# EAGLE design MK2560EM-G v2 (EAGLE 9.6.2)
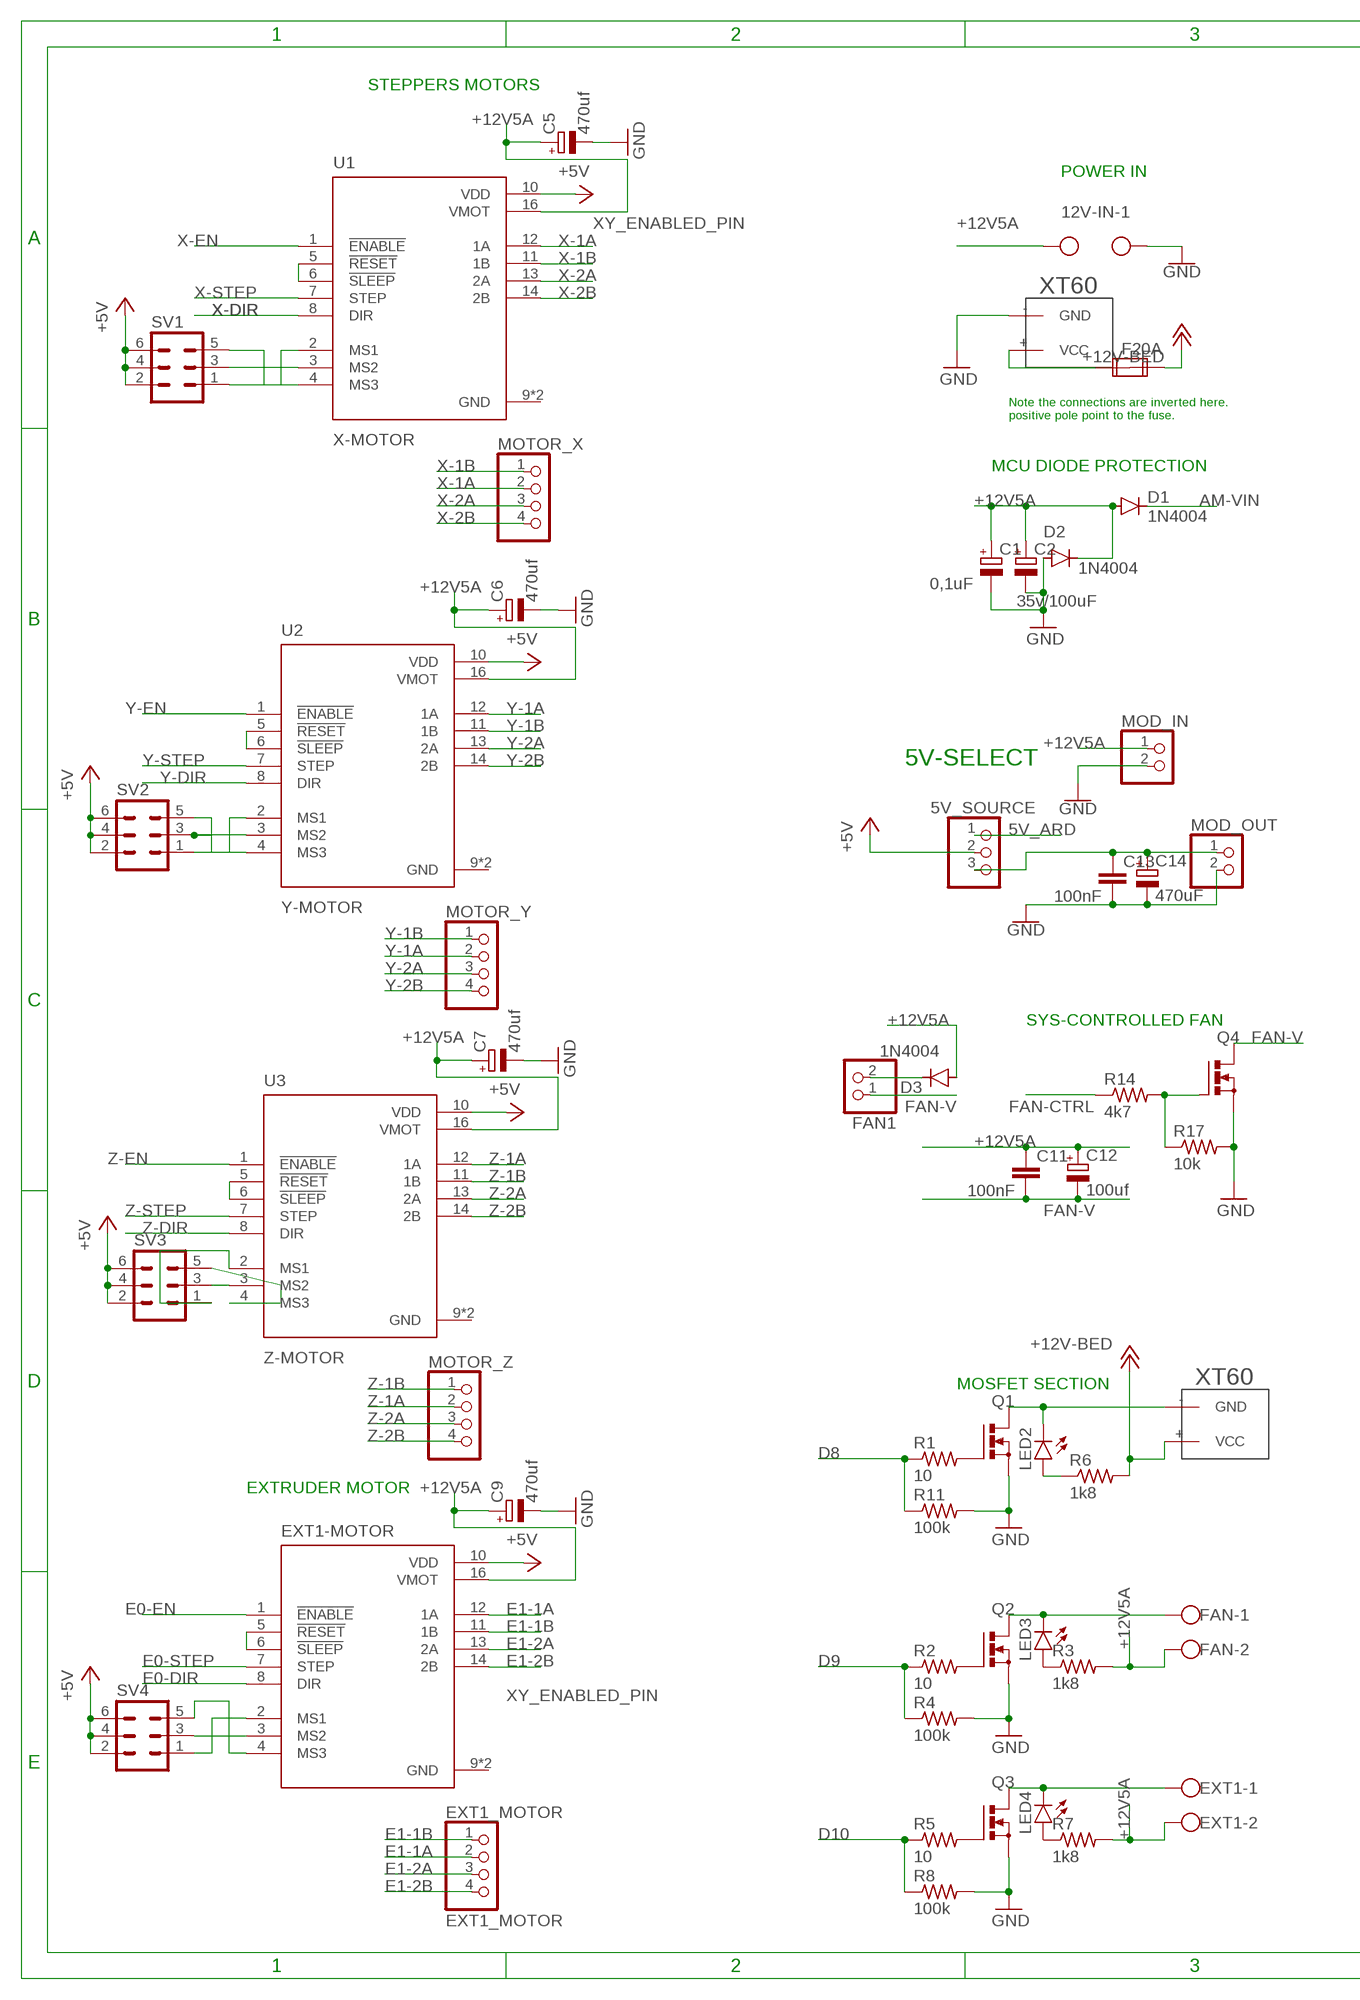
[diagram p0: schematic, sheet 1, part 1 of 2]
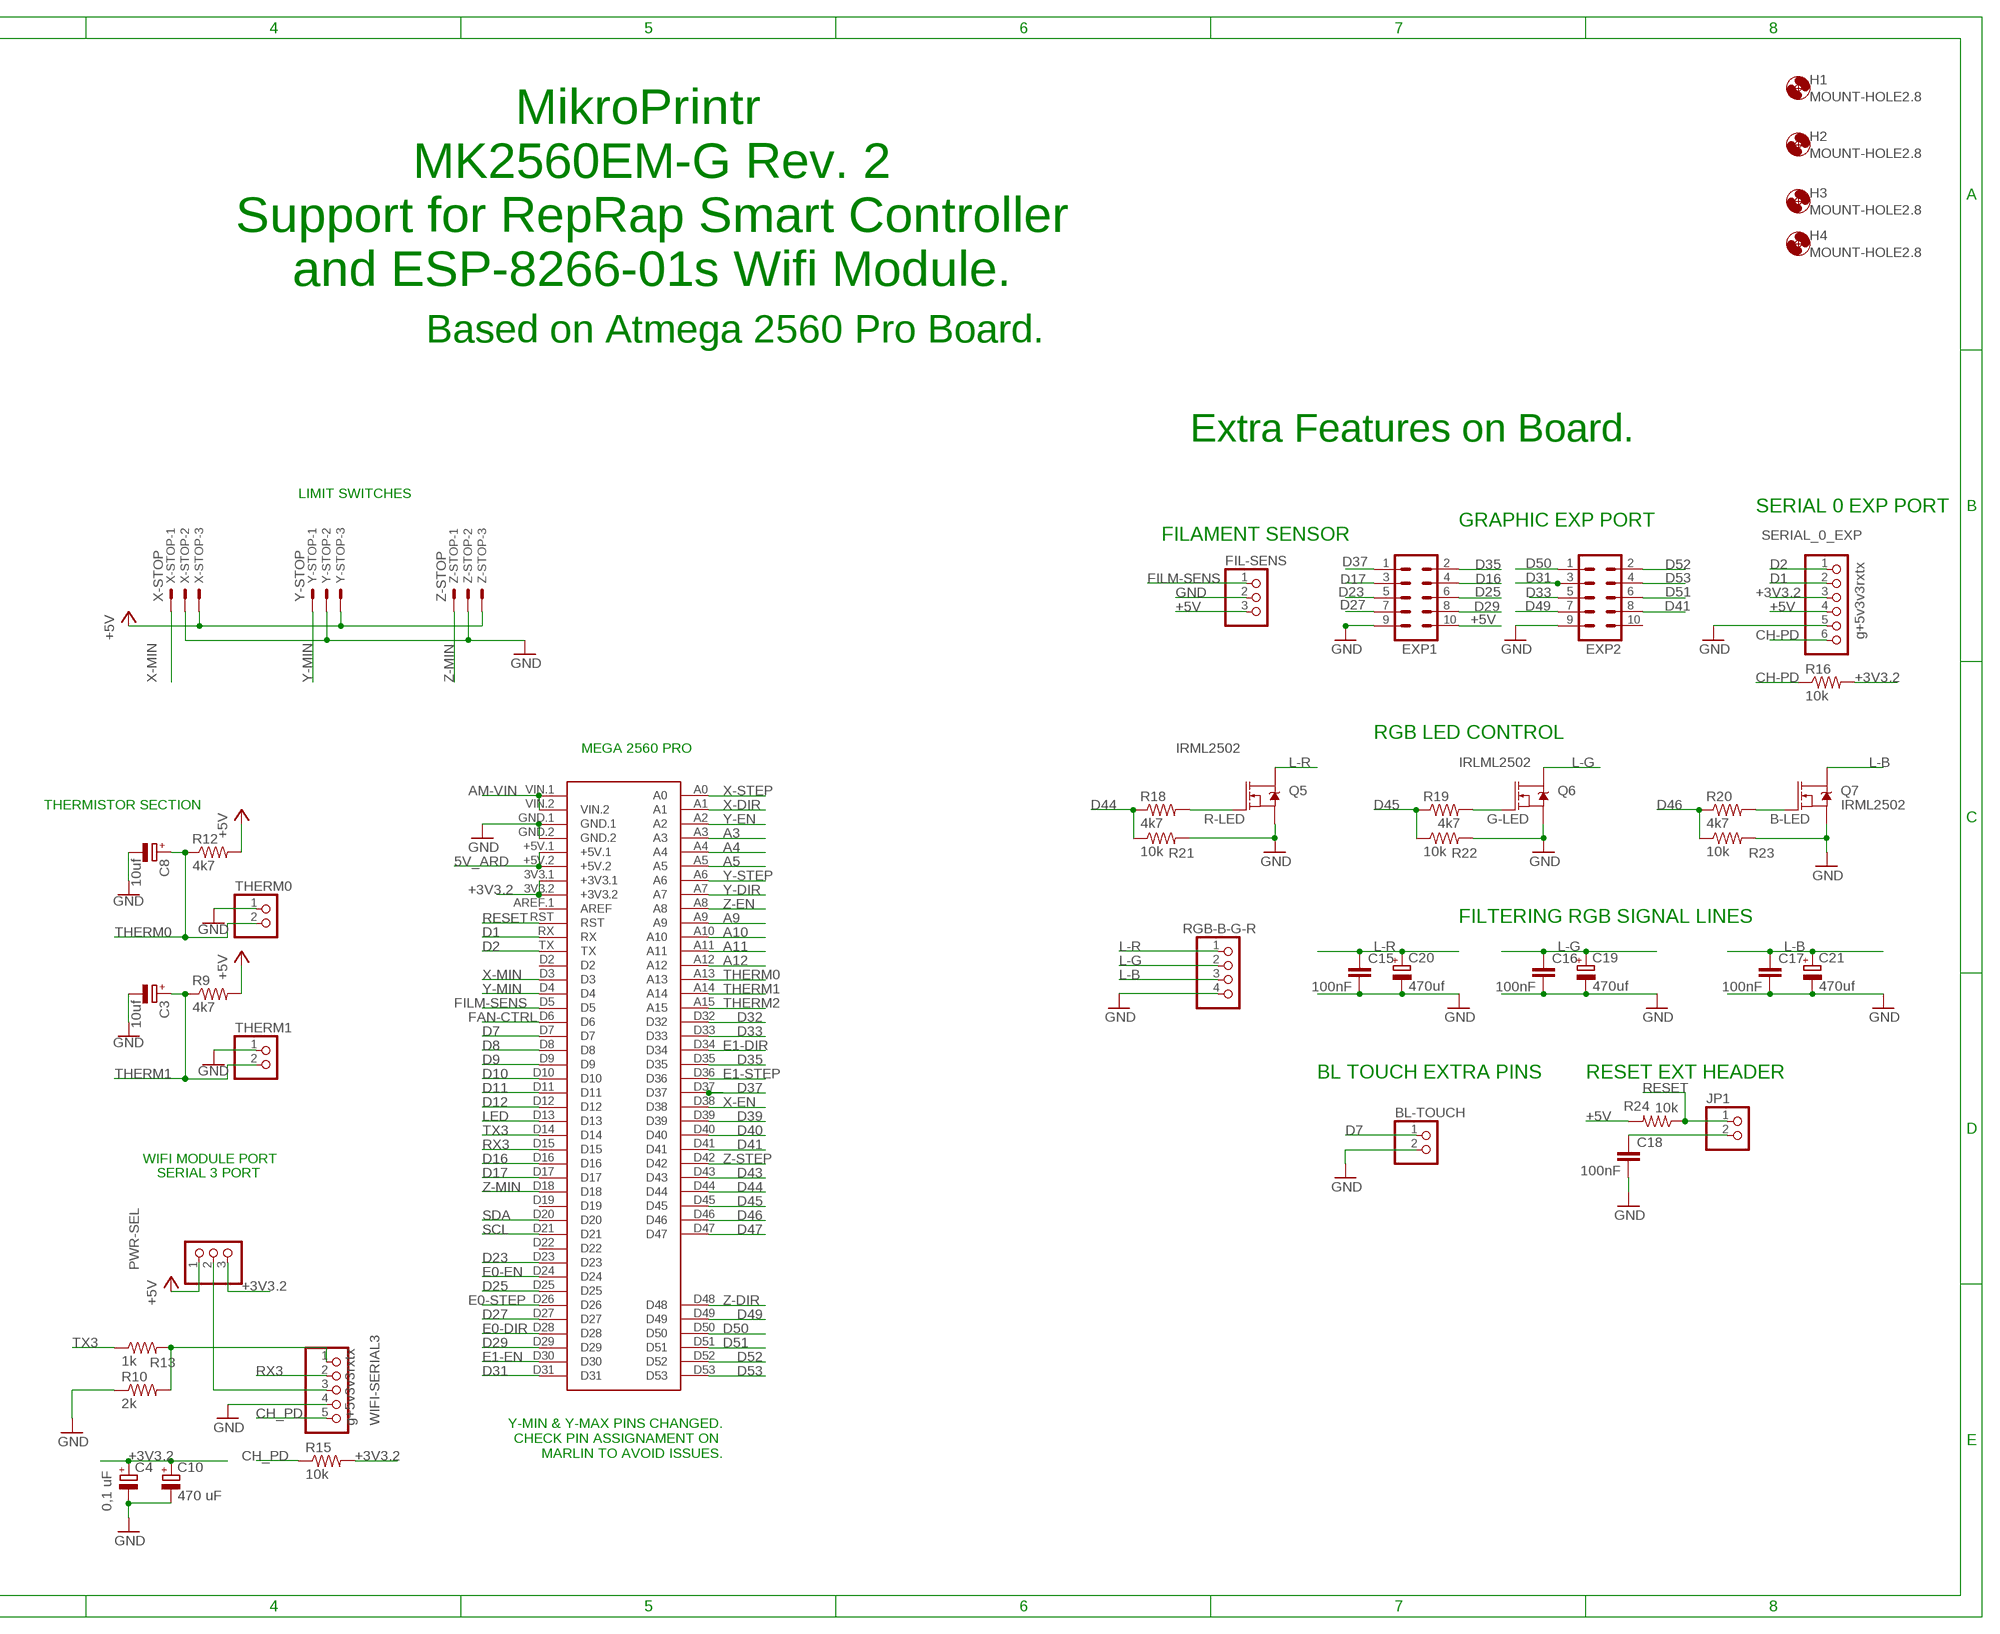
[diagram p1: schematic, sheet 1, part 2 of 2]

## Parts
5V_SOURCE  PINHD-1X3  [1X03]
12V-IN  W237-102  [W237-102]
ARD-MEGA  MEGA2560_MIKRO  [MEGA2560_MIKRO]
BL-TOUCH  PINHD-1X2  [1X02]
C1  0,1uF  CPOL-EUE2.5-5  [E2,5-5]
C2  35v/100uF  CPOL-EUE2.5-5  [E2,5-5]
C3  10uf  CPOL-EUE2.5-6  [E2,5-6]
C4  0,1 uF  CPOL-EUE2.5-5  [E2,5-5]
C5  470uf  CPOL-EUE2,5-6E  [E2,5-6E]
C6  470uf  CPOL-EUE2,5-6E  [E2,5-6E]
C7  470uf  CPOL-EUE2,5-6E  [E2,5-6E]
C8  10uf  CPOL-EUE2.5-6  [E2,5-6]
C9  470uf  CPOL-EUE2,5-6E  [E2,5-6E]
C10  470 uF  CPOL-EUE2.5-5  [E2,5-5]
C11  100nF  C2.5/2  [C2.5-2]
C12  100uf  CPOL-EUE2.5-6  [E2,5-6]
C13  100nF  C2.5/2  [C2.5-2]
C14  470uF  CPOL-EUE2.5-6  [E2,5-6]
C15  100nF  C2.5/2  [C2.5-2]
C16  100nF  C2.5/2  [C2.5-2]
C17  100nF  C2.5/2  [C2.5-2]
C18  100nF  C2.5/2  [C2.5-2]
C19  470uf  CPOL-EUE2,5-6E  [E2,5-6E]
C20  470uf  CPOL-EUE2,5-6E  [E2,5-6E]
C21  470uf  CPOL-EUE2,5-6E  [E2,5-6E]
D1  1N4004  [DO41-10]
D2  1N4004  [DO41-10]
D3  1N4004  [DO41-10]
EXP1  MA05-2  [MA05-2]
EXP2  MA05-2  [MA05-2]
EXT1  W237-102  [W237-102]
EXT1-MOTOR  A4988_STEPPER_MOTOR_DRIVER_CARRIER  [MODULE_A4988_STEPPER_MOTOR_DRIVER_CARRIER]
EXT1_MOTOR  EXT1_MOTOR  PINHD-1X4  [1X04]
F20A  FUSE2P  [FUSE1]
FAN  W237-102  [W237-102]
FAN1  PINHD-1X2  [1X02]
FIL-SENS  PINHD-1X3  [1X03]
H1  MOUNT-HOLE2.8  [2,8]
H2  MOUNT-HOLE2.8  [2,8]
H3  MOUNT-HOLE2.8  [2,8]
H4  MOUNT-HOLE2.8  [2,8]
JP1  PINHD-1X2  [1X02]
LED2  LED3MM  [LED3MM]
LED3  LED3MM  [LED3MM]
LED4  LED3MM  [LED3MM]
MOD_IN  PINHD-1X2  [1X02]
MOD_OUT  PINHD-1X2  [1X02]
MOTOR_X  PINHD-1X4  [1X04]
MOTOR_Y  PINHD-1X4  [1X04]
MOTOR_Z  PINHD-1X4  [1X04]
PWR-SEL  PINHD-1X3  [1X03]
Q1  PMOSFET_NTO220BV  [TO220BV]
Q2  PMOSFET_NTO220BV  [TO220BV]
Q3  PMOSFET_NTO220BV  [TO220BV]
Q4  PMOSFET_NTO220BV  [TO220BV]
Q5  IRML2502  MOSFET-NCH-AO3404A  [SOT23-3]
Q6  IRLML2502  MOSFET-NCH-AO3404A  [SOT23-3]
Q7  IRML2502  MOSFET-NCH-AO3404A  [SOT23-3]
R1  10  R-US_0204/7  [0204/7]
R2  10  R-US_0204/7  [0204/7]
R3  1k8  R-US_0204/7  [0204/7]
R4  100k  R-US_0204/7  [0204/7]
R5  10  R-US_0204/7  [0204/7]
R6  1k8  R-US_0204/7  [0204/7]
R7  1k8  R-US_0204/7  [0204/7]
R8  100k  R-US_0204/7  [0204/7]
R9  4k7  R-US_0204/7  [0204/7]
R10  2k  R-US_0204/7  [0204/7]
R11  100k  R-US_0204/7  [0204/7]
R12  4k7  R-US_0204/7  [0204/7]
R13  1k  R-US_0204/7  [0204/7]
R14  4k7  R-US_0204/7  [0204/7]
R15  10k  R-US_0204/7  [0204/7]
R16  10k  R-US_0204/7  [0204/7]
R17  10k  R-US_0204/7  [0204/7]
R18  4k7  R-US_0204/7  [0204/7]
R19  4k7  R-US_0204/7  [0204/7]
R20  4k7  R-US_0204/7  [0204/7]
R21  10k  R-US_0204/7  [0204/7]
R22  10k  R-US_0204/7  [0204/7]
R23  10k  R-US_0204/7  [0204/7]
R24  10k  R-US_0204/7  [0204/7]
RGB-B-G-R  PINHD-1X4  [1X04]
SERIAL_0_EXP  g+5v3v3rxtx  PINHD-1X6  [1X06]
SV1  MA03-2  [MA03-2]
SV2  MA03-2  [MA03-2]
SV3  MA03-2  [MA03-2]
SV4  MA03-2  [MA03-2]
THERM0  PINHD-1X2  [1X02]
THERM1  PINHD-1X2  [1X02]
U1  X-MOTOR  A4988_STEPPER_MOTOR_DRIVER_CARRIER  [MODULE_A4988_STEPPER_MOTOR_DRIVER_CARRIER]
U2  Y-MOTOR  A4988_STEPPER_MOTOR_DRIVER_CARRIER  [MODULE_A4988_STEPPER_MOTOR_DRIVER_CARRIER]
U3  Z-MOTOR  A4988_STEPPER_MOTOR_DRIVER_CARRIER  [MODULE_A4988_STEPPER_MOTOR_DRIVER_CARRIER]
U$1  XT60  [XT60]
U$2  XT60  [XT60]
WIFI-SERIAL3  g+5v3v3rxtx  PINHD-1X5  [1X05]
X-STOP  X-STOP  22-23-2031  [22-23-2031]
Y-STOP  Y-STOP  22-23-2031  [22-23-2031]
Z-STOP  Z-STOP  22-23-2031  [22-23-2031]

## Nets
5V_ARD: 5V_SOURCE.1 ARD-MEGA.+5V.1 ARD-MEGA.+5V.2
+3V3.2: ARD-MEGA.3V3.1(+3V3.1) ARD-MEGA.3V3.2(+3V3.2) C4.+ C10.+ PWR-SEL.3 R15.2 R16.2 SERIAL_0_EXP.3
+5V: 5V_SOURCE.2 EXP1.10 EXT1-MOTOR.10(VDD) FIL-SENS.3 PWR-SEL.1 R9.2 R12.2 R24.2 SERIAL_0_EXP.4 SV1.2 SV1.4 SV1.6 SV2.2 SV2.4 SV2.6 SV3.2 SV3.4 SV3.6 SV4.2 SV4.4 SV4.6 U1.10(VDD) U2.10(VDD) U3.10(VDD) X-STOP.3 Y-STOP.3 Z-STOP.3
+12V: F20A.2A R6.2 U$2.+(VCC) ; supply symbol labelled +12V-BED
+12V5A: 12V-IN.2 C1.+ C2.+ C5.+ C6.+ C7.+ C9.+ C11.1 C12.+ D1.A D2.C D3.A EXT1-MOTOR.16(VMOT) EXT1.2 FAN.2 MOD_IN.1 R3.2 R7.2 U1.16(VMOT) U2.16(VMOT) U3.16(VMOT)
A3: ARD-MEGA.A3
A4: ARD-MEGA.A4
A5: ARD-MEGA.A5
A9: ARD-MEGA.A9
A10: ARD-MEGA.A10
A11: ARD-MEGA.A11
A12: ARD-MEGA.A12
AM-VIN: ARD-MEGA.VIN.1 ARD-MEGA.VIN.2 D1.C
B-LED: Q7.1(G) R20.2
CH-PD: R16.1 SERIAL_0_EXP.6
CH_PD: R15.1 WIFI-SERIAL3.5
D1: ARD-MEGA.RX SERIAL_0_EXP.2
D2: ARD-MEGA.TX SERIAL_0_EXP.1
D7: ARD-MEGA.D7 BL-TOUCH.1
D8: ARD-MEGA.D8 R1.1 R11.1
D9: ARD-MEGA.D9 R2.1 R4.1
D10: ARD-MEGA.D10 R5.1 R8.1
D11: ARD-MEGA.D11
D12: ARD-MEGA.D12
D16: ARD-MEGA.D16 EXP1.4
D17: ARD-MEGA.D17 EXP1.3
D23: ARD-MEGA.D23 EXP1.5
D25: ARD-MEGA.D25 EXP1.6
D27: ARD-MEGA.D27 EXP1.7
D29: ARD-MEGA.D29 EXP1.8
D31: ARD-MEGA.D31 EXP2.3
D32: ARD-MEGA.D32
D33: ARD-MEGA.D33 EXP2.5
D35: ARD-MEGA.D35 EXP1.2
D37: ARD-MEGA.D37 EXP1.1
D39: ARD-MEGA.D39
D40: ARD-MEGA.D40
D41: ARD-MEGA.D41 EXP2.8
D43: ARD-MEGA.D43
D44: ARD-MEGA.D44 R18.1 R21.1
D45: ARD-MEGA.D45 R19.1 R22.1
D46: ARD-MEGA.D46 R20.1 R23.1
D47: ARD-MEGA.D47
D49: ARD-MEGA.D49 EXP2.7
D50: ARD-MEGA.D50 EXP2.1
D51: ARD-MEGA.D51 EXP2.6
D52: ARD-MEGA.D52 EXP2.2
D53: ARD-MEGA.D53 EXP2.4
E0-DIR: ARD-MEGA.D28 EXT1-MOTOR.8(DIR)
E0-EN: ARD-MEGA.D24 EXT1-MOTOR.1(!ENABLE)
E0-STEP: ARD-MEGA.D26 EXT1-MOTOR.7(STEP)
E1-1A: EXT1-MOTOR.12(1A) EXT1_MOTOR.2
E1-1B: EXT1-MOTOR.11(1B) EXT1_MOTOR.1
E1-2A: EXT1-MOTOR.13(2A) EXT1_MOTOR.3
E1-2B: EXT1-MOTOR.14(2B) EXT1_MOTOR.4
E1-DIR: ARD-MEGA.D34
E1-EN: ARD-MEGA.D30
E1-STEP: ARD-MEGA.D36
FAN-CTRL: ARD-MEGA.D6 R14.1
FAN-V: C11.2 C12.- FAN1.1 Q4.D
FILM-SENS: ARD-MEGA.D5 FIL-SENS.1
G-LED: Q6.1(G) R19.2
GND: 12V-IN.1 ARD-MEGA.GND.1 ARD-MEGA.GND.2 BL-TOUCH.2 C1.- C2.- C3.- C4.- C5.- C6.- C7.- C8.- C9.- C10.- C13.2 C14.- C15.2 C16.2 C17.2 C18.2 C19.- C20.- C21.- D2.A EXP1.9 EXP2.9 FIL-SENS.2 MOD_IN.2 MOD_OUT.2 Q1.S Q2.S Q3.S Q4.S Q5.2(S) Q6.2(S) Q7.2(S) R4.2 R8.2 R10.1 R11.2 R17.2 R21.2 R22.2 R23.2 RGB-B-G-R.4 SERIAL_0_EXP.5 THERM0.1 THERM1.1 U$1.-(GND) WIFI-SERIAL3.4 X-STOP.2 Y-STOP.2 Z-STOP.2
L-B: C17.1 C21.+ Q7.3(D) RGB-B-G-R.3
L-G: C16.1 C19.+ Q6.3(D) RGB-B-G-R.2
L-R: C15.1 C20.+ Q5.3(D) RGB-B-G-R.1
LED: ARD-MEGA.D13
N$1: Q2.G R2.2
N$2: FAN.1 LED3.K(C) Q2.D
N$3: LED3.A R3.1
N$4: Q3.G R5.2
N$5: EXT1.1 LED4.K(C) Q3.D
N$6: LED4.A R7.1
N$7: LED2.K(C) Q1.D U$2.-(GND)
N$8: LED2.A R6.1
N$9: SV1.5 U1.4(MS3)
N$10: SV1.3 U1.3(MS2)
N$11: SV1.1 U1.2(MS1)
N$12: U2.5(!RESET) U2.6(!SLEEP)
N$13: U1.5(!RESET) U1.6(!SLEEP)
N$14: SV2.1 U2.2(MS1)
N$15: SV2.3 U2.3(MS2)
N$16: SV2.5 U2.4(MS3)
N$17: U3.5(!RESET) U3.6(!SLEEP)
N$18: R10.2 R13.2 WIFI-SERIAL3.1
N$19: SV3.3 U3.3(MS2)
N$20: Q1.G R1.2
N$21: SV3.1 U3.2(MS1)
N$22: SV3.5 U3.4(MS3)
N$23: EXT1-MOTOR.5(!RESET) EXT1-MOTOR.6(!SLEEP)
N$24: EXT1-MOTOR.3(MS2) SV4.3
N$25: EXT1-MOTOR.4(MS3) SV4.5
N$26: EXT1-MOTOR.2(MS1) SV4.1
N$27: Q4.G R14.2 R17.1
N$28: D3.C FAN1.2
N$29: F20A.1A U$1.+(VCC)
N$30: 5V_SOURCE.3 C13.1 C14.+ MOD_OUT.1
N$32: PWR-SEL.2 WIFI-SERIAL3.3
N$33: C18.1 JP1.2
R-LED: Q5.1(G) R18.2
RESET: ARD-MEGA.RST JP1.1 R24.1
RX3: ARD-MEGA.D15 WIFI-SERIAL3.2
SCL: ARD-MEGA.D21
SDA: ARD-MEGA.D20
THERM0: ARD-MEGA.A13 C8.+ R12.1 THERM0.2
THERM1: ARD-MEGA.A14 C3.+ R9.1 THERM1.2
THERM2: ARD-MEGA.A15
TX3: ARD-MEGA.D14 R13.1
X-1A: MOTOR_X.2 U1.12(1A)
X-1B: MOTOR_X.1 U1.11(1B)
X-2A: MOTOR_X.3 U1.13(2A)
X-2B: MOTOR_X.4 U1.14(2B)
X-DIR: ARD-MEGA.A1 U1.8(DIR)
X-EN: ARD-MEGA.D38 U1.1(!ENABLE)
X-MIN: ARD-MEGA.D3 X-STOP.1
X-STEP: ARD-MEGA.A0 U1.7(STEP)
Y-1A: MOTOR_Y.2 U2.12(1A)
Y-1B: MOTOR_Y.1 U2.11(1B)
Y-2A: MOTOR_Y.3 U2.13(2A)
Y-2B: MOTOR_Y.4 U2.14(2B)
Y-DIR: ARD-MEGA.A7 U2.8(DIR)
Y-EN: ARD-MEGA.A2 U2.1(!ENABLE)
Y-MIN: ARD-MEGA.D4 Y-STOP.1
Y-STEP: ARD-MEGA.A6 U2.7(STEP)
Z-1A: MOTOR_Z.2 U3.12(1A)
Z-1B: MOTOR_Z.1 U3.11(1B)
Z-2A: MOTOR_Z.3 U3.13(2A)
Z-2B: MOTOR_Z.4 U3.14(2B)
Z-DIR: ARD-MEGA.D48 U3.8(DIR)
Z-EN: ARD-MEGA.A8 U3.1(!ENABLE)
Z-MIN: ARD-MEGA.D18 Z-STOP.1
Z-STEP: ARD-MEGA.D42 U3.7(STEP)
Unconnected: ARD-MEGA.AREF.1(AREF) ARD-MEGA.D2 ARD-MEGA.D19 ARD-MEGA.D22 EXP2.10 F20A.1B F20A.2B

## Notes on the sheet
- STEPPERS MOTORS
- POWER IN
- MikroPrintr  
  MK2560EM-G Rev. 2
  Support for RepRap Smart Controller
  and ESP-8266-01s Wifi Module.
- Note the connections are inverted here.
  positive pole point to the fuse.
- Based on Atmega 2560 Pro Board.
- MCU DIODE PROTECTION
- Extra Features on Board.
- LIMIT SWITCHES
- SERIAL 0 EXP PORT
- GRAPHIC EXP PORT
- FILAMENT SENSOR
- 5V-SELECT
- RGB LED CONTROL
- MEGA 2560 PRO
- THERMISTOR SECTION
- SYS-CONTROLLED FAN
- FILTERING RGB SIGNAL LINES
- BL TOUCH EXTRA PINS | RESET EXT HEADER
- MOSFET SECTION
- WIFI MODULE PORT
- SERIAL 3 PORT
- EXTRUDER MOTOR
- Y-MIN & Y-MAX PINS CHANGED.
  CHECK PIN ASSIGNAMENT ON 
  MARLIN TO AVOID ISSUES.

## Power pins joined to a net without a drawn wire
GND: EXT1-MOTOR.9(GND) EXT1-MOTOR.15(GND) U1.9(GND) U1.15(GND) U2.9(GND) U2.15(GND) U3.9(GND) U3.15(GND)

## Library data of the parts
5V_SOURCE = pinhead:PINHD-1X3: PIN HEADER
12V-IN EXT1 FAN = con-wago-500:W237-102: WAGO SCREW CLAMP; MPN: 237-102; OC_FARNELL: unknown; OC_NEWARK: 70K9898
ARD-MEGA = MIKRO_MEGA2560:MEGA2560_MIKRO: Arduino Mega2560 pro robotDyn, create by mikroavr.com
BL-TOUCH JP1 THERM0 THERM1 = -redpic-connector:PINHD-1X2: Pin Header 2
C1-C10 C12 C14 C19-C21 = rcl:CPOL-EU: POLARIZED CAPACITOR, European symbol; SPICEPREFIX: C
C11 C13 C15-C18 = capacitor-wima:C: CAPACITOR naming: grid - package width
D1-D3 = diode:1N4004: DIODE general purpose rectifier, 1 A
EXP1 EXP2 = con-lstb:MA05-2: PIN HEADER; OC_FARNELL: unknown; OC_NEWARK: unknown
EXT1-MOTOR U1-U3 = A4988_STEPPER_MOTOR_DRIVER_CARRIER:A4988_STEPPER_MOTOR_DRIVER_CARRIER: Stepper motor controler; IC: A4988; 1A; Uin mot: 8÷35V Check availability <https://pricing.snapeda.com/parts/A4988%20STEPPER%20MOTOR%20DRIVER%20CARRIER/Pololu/view-part?ref=eda>; AVAILABILITY: Not in stock; DESCRIPTION: Stepper Motor Driver; MF: Pololu; MP: A4988 STEPPER MOTOR DRIVER CARRIER; PACKAGE: None; PRICE: None
EXT1_MOTOR MOTOR_X MOTOR_Y MOTOR_Z RGB-B-G-R = -redpic-connector:PINHD-1X4: Pin Header 4
F20A = special:FUSE2P: FUSE 5 x 20 mm
FAN1 MOD_IN MOD_OUT = pinhead:PINHD-1X2: PIN HEADER
FIL-SENS PWR-SEL = -redpic-connector:PINHD-1X3: Pin Header 3
H1-H4 = holes:MOUNT-HOLE: MOUNTING HOLE with drill center marker
LED2-LED4 = led:LED: LED OSRAM: - CHIPLED LG R971, LG N971, LY N971, LG Q971, LY Q971, LO R971, LY R971 LH N974, LH R974 LS Q976, LO Q976, LY Q976 LO Q996 - Hyper CHIPLED LW Q18S LB Q993, LB Q99A, LB R99A - SideLED LS A670, LO A670, LY A670, LG A670, LP A670 LB A673, LV A673, LT A673, LW A673 LH A674 LY A675 LS A676, LA A676, LO A676, LY A676, LW A676 LS A679, LY A679, LG A679 - Hyper Micro SIDELED® LS Y876, LA Y876, LO Y876, LY Y876 LT Y87S - SmartLED LW L88C, LW L88S LB L89C, LB L89S, LG L890 LS L89K, LO L89K, LY L89K LS L896, LA L896, LO L896, LY L896 - TOPLED LS T670, LO T670, LY T670, LG T670, LP T670 LSG T670, LSP T670, LSY T670, LOP T670, LYG T670 LG T671, LOG T671, LSG T671 LB T673, LV T673, LT T673, LW T673 LH T674 LS T676, LA T676, LO T676, LY T676, LB T676, LH T676, LSB T676, LW T676 LB T67C, LV T67C, LT T67C, LS T67K, LO T67K, LY T67K, LW E67C LS E67B, LA E67B, LO E67B, LY E67B, LB E67C, LV E67C, LT E67C LW T67C LS T679, LY T679, LG T679 LS T770, LO T770, LY T770, LG T770, LP T770 LB T773, LV T773, LT T773, LW T773 LH T774 LS E675, LA E675, LY E675, LS T675 LS T776, LA T776, LO T776, LY T776, LB T776 LHGB T686 LT T68C, LB T68C - Hyper Mini TOPLED® LB M676 - Mini TOPLED Santana® LG M470 LS M47K, LO M47K, LY M47K Source: http://www.osram.convergy.de LUXEON: - LUMILED® LXK2-PW12-R00, LXK2-PW12-S00, LXK2-PW14-U00, LXK2-PW14-V00 LXK2-PM12-R00, LXK2-PM12-S00, LXK2-PM14-U00 LXK2-PE12-Q00, LXK2-PE12-R00, LXK2-PE12-S00, LXK2-PE14-T00, LXK2-PE14-U00 LXK2-PB12-K00, LXK2-PB12-L00, LXK2-PB12-M00, LXK2-PB14-N00, LXK2-PB14-P00, LXK2-PB14-Q00 LXK2-PR12-L00, LXK2-PR12-M00, LXK2-PR14-Q00, LXK2-PR14-R00 LXK2-PD12-Q00, LXK2-PD12-R00, LXK2-PD12-S00 LXK2-PH12-R00, LXK2-PH12-S00 LXK2-PL12-P00, LXK2-PL12-Q00, LXK2-PL12-R00 Source: www.luxeon.com KINGBRIGHT: KA-3528ASYC Source: www.kingbright.com
Q1-Q4 = transistor-power:PMOSFET_N: Power MOSFET N-Channel
Q5-Q7 = SparkFun-DiscreteSemi:MOSFET-NCH: N-channel MOSFETs Voltage controlled devices that allow control of high current outputs. SparkFun Products: SparkFun OpenScale <https://www.sparkfun.com/products/13261> SparkFun Digital Sandbox <https://www.sparkfun.com/products/12651> SparkFun Monster Moto Shield <https://www.sparkfun.com/products/10182> SparkFun MOSFET Power Controller <https://www.sparkfun.com/products/11214>; PROD_ID: TRANS-12988; VALUE: 5.8A/30V/35mΩ
R1-R24 = resistor:R-US_: RESISTOR, American symbol
SERIAL_0_EXP = pinhead:PINHD-1X6: PIN HEADER
SV1-SV4 = con-lstb:MA03-2: PIN HEADER; OC_FARNELL: unknown; OC_NEWARK: unknown
U$1 U$2 = XT60:XT60: XT60
WIFI-SERIAL3 = pinhead:PINHD-1X5: PIN HEADER
X-STOP Y-STOP Z-STOP = con-molex:22-23-2031: .100" (2.54mm) Center Header - 3 Pin; MF: MOLEX; MPN: 22-23-2031; OC_FARNELL: 1462950; OC_NEWARK: 30C0862

## Board
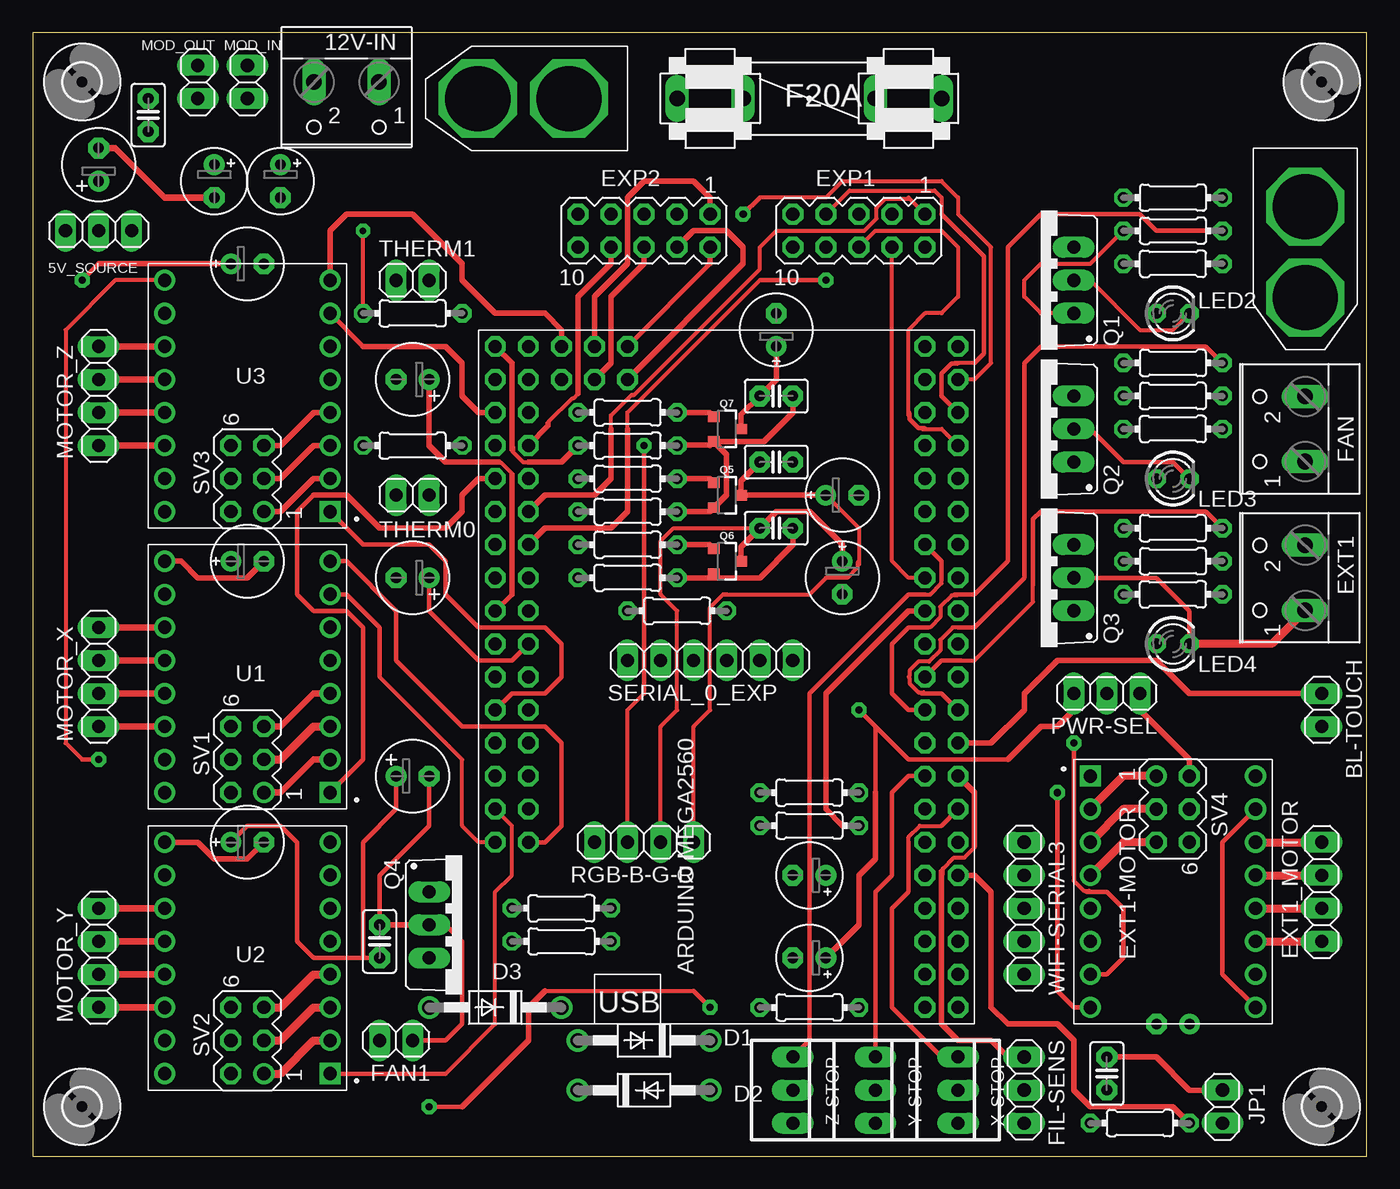
[diagram p2: board, top side]
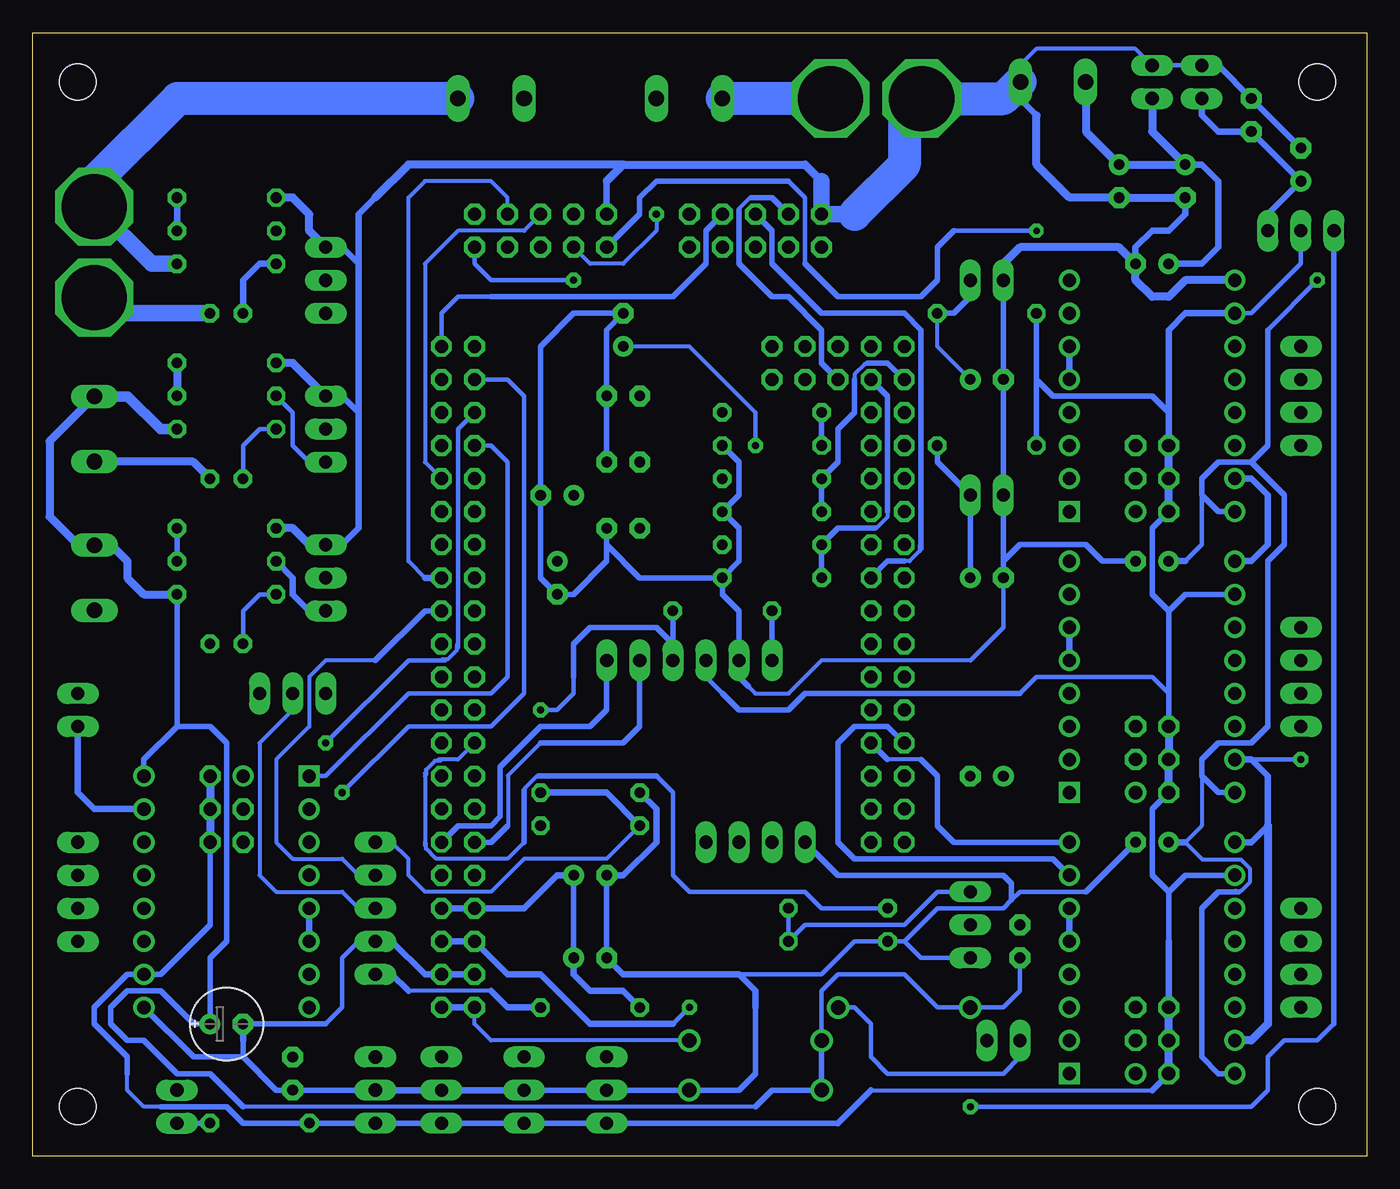
[diagram p3: board, bottom side, seen from below]

Size 102.54 x 86.35 mm. Coordinates in mm from the lower left corner, seen from the top.
Outline: 0,0 102.54,0 102.54,86.35 0,86.35 0,0
Copper layers (1*16): Top 0.035mm / dielectric 1.5mm / Bottom 0.035mm
Design rules "China_JLCPCB": minimum track width 0.25mm, minimum drill 0.5mm, track to track 0.24mm, track to pad 0.23mm, pad to pad 0.2mm, via to via 0.25mm, smd to smd 0.2mm, copper to edge 0.5mm, drill to drill 0.3mm, minimum pad ring 0.3mm, minimum via ring 0.3mm, stop-mask expansion 3mil, vias tented up to drill 0.6mm, thermal gap 20mil

### Footprints (pad centres in the part's own frame; a part is rotated, then mirrored left to right if it is on the bottom)
1X03 = drill 1.016 long: 1 -2.54,0; 2 0,0; 3 2.54,0
W237-102 = drill 1.194 long: 1 -2.5,-1.27; 2 2.5,-1.27
MEGA2560_MIKRO = drill 1 octagon: 3V3.1 -26.67,-17.78; 3V3.2 -26.67,-20.32; +5V.1 -29.21,-17.78; +5V.2 -29.21,-20.32; A0 -21.59,15.24; A1 -21.59,12.7; A2 -19.05,15.24; A3 -19.05,12.7; A4 -16.51,15.24; A5 -16.51,12.7; A6 -13.97,15.24; A7 -13.97,12.7; A8 -11.43,15.24; A9 -11.43,12.7; A10 -8.89,15.24; A11 -8.89,12.7; A12 -6.35,15.24; A13 -6.35,12.7; A14 -3.81,15.24; A15 -3.81,12.7; AREF.1 -24.13,-17.78; D2 -19.05,-17.78; D3 -19.05,-20.32; D4 -16.51,-17.78; D5 -16.51,-20.32; D6 -13.97,-17.78; D7 -13.97,-20.32; D8 -11.43,-17.78; D9 -11.43,-20.32; D10 -8.89,-17.78; D11 -8.89,-20.32; D12 -6.35,-17.78; D13 -6.35,-20.32; D14 -3.81,-17.78; D15 -3.81,-20.32; D16 -1.27,-17.78; D17 -1.27,-20.32; D18 1.27,-17.78; D19 1.27,-20.32; D20 3.81,-17.78; D21 3.81,-20.32; D22 6.35,-17.78; D23 6.35,-20.32; D24 8.89,-17.78; D25 8.89,-20.32; D26 11.43,-17.78; D27 11.43,-20.32; D28 13.97,-17.78; D29 13.97,-20.32; D30 16.51,-17.78; D31 16.51,-20.32; D32 -1.27,15.24; D33 -1.27,12.7; D34 1.27,15.24; D35 1.27,12.7; D36 3.81,15.24; D37 3.81,12.7; D38 6.35,15.24; D39 6.35,12.7; D40 8.89,15.24; D41 8.89,12.7; D42 11.43,15.24; D43 11.43,12.7; D44 13.97,15.24; D45 13.97,12.7; D46 16.51,15.24; D47 16.51,12.7; D48 16.51,10.16; D49 13.97,10.16; D50 16.51,7.62; D51 13.97,7.62; D52 16.51,5.08; D53 13.97,5.08; GND.1 -31.75,-17.78; GND.2 -31.75,-20.32; RST -24.13,-20.32; RX -21.59,-17.78; TX -21.59,-20.32; VIN.1 -34.29,-17.78; VIN.2 -34.29,-20.32
1X02 = drill 1.016 long: 1 -1.27,0; 2 1.27,0
E2,5-5 = drill 0.813 pad 1.6: + -1.27,0 | drill 0.813 pad 1.6 octagon: - 1.27,0
E2,5-6 = drill 0.813 pad 1.6: + -1.27,0 | drill 0.813 pad 1.6 octagon: - 1.27,0
E2,5-6E = drill 0.813 pad 1.575: + -1.27,0 | drill 0.813 pad 1.575 octagon: - 1.27,0
C2.5-2 = drill 0.813 pad 1.6 octagon: 1 -1.27,0; 2 1.27,0
DO41-10 = drill 1.118: A 5.08,0; C -5.08,0
MA05-2 = drill 1.016 octagon: 1 -5.08,-1.27; 2 -5.08,1.27; 3 -2.54,-1.27; 4 -2.54,1.27; 5 0,-1.27; 6 0,1.27; 7 2.54,-1.27; 8 2.54,1.27; 9 5.08,-1.27; 10 5.08,1.27
MODULE_A4988_STEPPER_MOTOR_DRIVER_CARRIER = drill 1.02 square: 1 -6.35,8.89 | drill 1.02: 2 -6.35,6.35; 3 -6.35,3.81; 4 -6.35,1.27; 5 -6.35,-1.27; 6 -6.35,-3.81; 7 -6.35,-6.35; 8 -6.35,-8.89; 9 6.35,-8.89; 10 6.35,-6.35; 11 6.35,-3.81; 12 6.35,-1.27; 13 6.35,1.27; 14 6.35,3.81; 15 6.35,6.35; 16 6.35,8.89
1X04 = drill 1.016 long: 1 -3.81,0; 2 -1.27,0; 3 1.27,0; 4 3.81,0
FUSE1 = drill 1.194 long: 1A -10.16,0; 1B -5.08,0; 2A 10.16,0; 2B 5.08,0
2,8 = hole 2.8: 0,0
LED3MM = drill 0.813 octagon: A -1.27,0; K 1.27,0
TO220BV = drill 1.016 long: D 0,-2.54; G -2.54,-2.54; S 2.54,-2.54
SOT23-3 = smd 0.8 x 0.9: 1 -0.95,-1; 2 0.95,-1; 3 0,1.1
0204/7 = drill 0.813 octagon: 1 -3.81,0; 2 3.81,0
1X06 = drill 1.016 long: 1 -6.35,0; 2 -3.81,0; 3 -1.27,0; 4 1.27,0; 5 3.81,0; 6 6.35,0
MA03-2 = drill 1.016: 1 -2.54,-1.27 | drill 1.016 octagon: 2 -2.54,1.27; 3 0,-1.27; 4 0,1.27; 5 2.54,-1.27; 6 2.54,1.27
XT60 = drill 5 octagon: + 4.5,0; - 11.5,0
1X05 = drill 1.016 long: 1 -5.08,0; 2 -2.54,0; 3 0,0; 4 2.54,0; 5 5.08,0
22-23-2031 = drill 1 long: 1 -2.54,0; 2 0,0; 3 2.54,0

### Placement (x,y rotation side)
5V_SOURCE  5.08,71.12 0 top
12V-IN  24.13,81.28 180 top
ARD-MEGA  50.8,45.72 90 top
BL-TOUCH  99.06,34.29 270 top
C1  13.97,74.93 270 top
C2  19.05,74.93 270 top
C3  29.21,59.69 180 top
C4  59.69,21.59 180 top
C5  16.51,24.13 0 top
C6  87.63,10.16 0 bottom
C7  16.51,68.58 0 top
C8  29.21,44.45 180 top
C9  16.51,45.72 0 top
C10  59.69,15.24 180 top
C11  26.67,16.51 90 top
C12  29.21,29.21 0 top
C13  8.89,80.01 90 top
C14  5.08,76.2 90 top
C15  57.15,53.34 0 top
C16  57.15,48.26 0 top
C17  57.15,58.42 0 top
C18  82.55,6.35 270 top
C19  62.23,44.45 270 top
C20  62.23,50.8 0 top
C21  57.15,63.5 90 top
D1  46.99,8.89 180 top
D2  46.99,5.08 0 top
D3  35.56,11.43 180 top
EXP1  63.5,71.12 180 top
EXP2  46.99,71.12 180 top
EXT1  96.52,44.45 90 top
EXT1-MOTOR  87.63,20.32 0 top
EXT1_MOTOR  99.06,20.32 90 top
F20A  59.69,81.28 0 top
FAN  96.52,55.88 90 top
FAN1  27.94,8.89 180 top
FIL-SENS  76.2,5.08 270 top
H1  99.06,82.55 0 top
H2  3.81,3.81 0 top
H3  3.81,82.55 0 top
H4  99.06,3.81 0 top
JP1  91.44,3.81 90 top
LED2  87.63,64.77 0 top
LED3  87.63,52.07 0 top
LED4  87.63,39.37 0 top
MOD_IN  16.51,82.55 90 top
MOD_OUT  12.7,82.55 90 top
MOTOR_X  5.08,36.83 270 top
MOTOR_Y  5.08,15.24 270 top
MOTOR_Z  5.08,58.42 270 top
PWR-SEL  82.55,35.56 180 top
Q1  77.47,67.31 90 top
Q2  77.47,55.88 90 top
Q3  77.47,44.45 90 top
Q4  33.02,17.78 270 top
Q5  53.34,50.8 270 top
Q6  53.34,45.72 270 top
Q7  53.34,55.88 270 top
R1  87.63,71.12 180 top
R2  87.63,58.42 180 top
R3  87.63,55.88 0 top
R4  87.63,60.96 180 top
R5  87.63,45.72 180 top
R6  87.63,68.58 0 top
R7  87.63,43.18 0 top
R8  87.63,48.26 180 top
R9  29.21,64.77 180 top
R10  59.69,27.94 0 top
R11  87.63,73.66 180 top
R12  29.21,54.61 180 top
R13  59.69,25.4 180 top
R14  40.64,19.05 0 top
R15  59.69,11.43 180 top
R16  49.53,41.91 0 top
R17  40.64,16.51 180 top
R18  45.72,52.07 0 top
R19  45.72,46.99 0 top
R20  45.72,57.15 0 top
R21  45.72,49.53 0 top
R22  45.72,44.45 0 top
R23  45.72,54.61 0 top
R24  85.09,2.54 180 top
RGB-B-G-R  46.99,24.13 180 top
SERIAL_0_EXP  52.07,38.1 180 top
SV1  16.51,30.48 90 top
SV2  16.51,8.89 90 top
SV3  16.51,52.07 90 top
SV4  87.63,26.67 270 top
THERM0  29.21,50.8 0 top
THERM1  29.21,67.31 0 top
U1  16.51,36.83 180 top
U2  16.51,15.24 180 top
U3  16.51,58.42 180 top
U$1  45.72,81.28 180 top
U$2  97.79,77.47 270 top
WIFI-SERIAL3  76.2,19.05 270 top
X-STOP  71.12,5.08 270 top
Y-STOP  64.77,5.08 270 top
Z-STOP  58.42,5.08 270 top

### Tracks (layer width: path | path; a pad name or v marks a point on that pad's centre or on a via)
5V_ARD  (via drill 0.55)
  Top 0.305: 39.37,12.7 50.8,12.7
  Top 0.356: 50.8,12.7 v52.07,11.43 | v30.48,3.81 33.02,3.81
  Top 0.406: 39.37,12.7 38.1,11.43 38.1,8.89 33.02,3.81
  Bottom 0.356: 2.54,10.16 3.81,8.89 6.35,8.89 7.62,7.62 7.62,5.08 8.89,3.81 v30.48,3.81 | v52.07,11.43 53.34,10.16
  Bottom 0.406: 5V_SOURCE.1 2.54,10.16
  Bottom 0.508: ARD-MEGA.+5V.2 ARD-MEGA.+5V.1 66.04,13.97 63.5,13.97 59.69,10.16 53.34,10.16
+3V3.2  (via drill 0.55)
  Top 0.356: v63.5,34.29 64.77,33.02 | 64.77,33.02 64.77,27.94 | 74.93,30.48 67.31,30.48 64.77,33.02
  Top 0.406: C10.+ 63.5,17.78 63.5,21.59 64.77,22.86 64.77,27.94 | PWR-SEL.3 80.01,34.29 78.74,33.02 77.47,33.02 74.93,30.48
  Bottom 0.356: 60.96,36.83 60.96,35.56 62.23,34.29 v63.5,34.29
  Bottom 0.406: C10.+ C4.+ | SERIAL_0_EXP.3 53.34,39.37 | 53.34,39.37 54.61,40.64 59.69,40.64 60.96,39.37 60.96,36.83 | R16.2 53.34,39.37
  Bottom 0.508: ARD-MEGA.3V3.2 ARD-MEGA.3V3.1 64.77,19.05 62.23,21.59 C4.+ | C10.+ 60.96,13.97 59.69,12.7 57.15,12.7 R15.2
+5V  (via drill 0.5)
  Top 0.305: R9.2 v25.4,71.12
  Top 0.406: SV4.2 88.9,30.48 85.09,34.29 PWR-SEL.1
  Bottom 0.305: 38.1,5.08 16.51,5.08 | 92.71,3.81 93.98,3.81 95.25,5.08 95.25,6.35
  Bottom 0.356: 44.45,74.93 43.18,73.66 43.18,68.58 | 5V_SOURCE.2 5.08,68.58 8.89,64.77 U3.10 | SERIAL_0_EXP.4 50.8,36.83 49.53,35.56 | 26.67,35.56 25.4,36.83 16.51,36.83 15.24,35.56 | 31.75,71.12 v25.4,71.12
  Bottom 0.406: SV4.6 88.9,17.78 92.71,13.97 EXT1-MOTOR.10 95.25,13.97 97.79,11.43 97.79,10.16 95.25,7.62 95.25,6.35 | SV1.2 16.51,26.67 16.51,21.59 15.24,20.32 | U2.10 13.97,21.59 15.24,20.32 | 15.24,20.32 15.24,16.51 | SV3.2 16.51,48.26 16.51,43.18 15.24,41.91 | SV1.6 15.24,35.56 15.24,41.91 | 15.24,41.91 13.97,43.18 U1.10 | R9.2 25.4,59.69 | 25.4,59.69 24.13,58.42 16.51,58.42 15.24,57.15 | 25.4,59.69 R12.2 | 26.67,35.56 43.18,35.56 44.45,34.29 48.26,34.29 49.53,35.56 | 44.45,74.93 54.61,74.93 55.88,73.66 55.88,72.39 EXP1.10 | 31.75,71.12 33.02,69.85 33.02,67.31 34.29,66.04 40.64,66.04 43.18,68.58 | 92.71,3.81 87.63,3.81 86.36,2.54 R24.2 FIL-SENS.3 X-STOP.3 Y-STOP.3 Z-STOP.3 40.64,2.54
  Bottom 0.508: SV3.6 15.24,57.15 15.24,63.5 13.97,64.77 U3.10 | 15.24,16.51 SV2.6 | 40.64,2.54 38.1,5.08 | 16.51,5.08 SV2.2
  Bottom 0.61: SV4.2 SV4.4 SV4.6 | SV3.2 SV3.4 SV3.6 | SV1.2 SV1.4 SV1.6 | SV2.2 SV2.4 SV2.6
+12V
  Bottom 1.27: U$2.+ 93.4,68.58 R6.2
  Bottom 2.54: F20A.2A 91.4,81.28 97.79,74.89 U$2.+
+12V5A  (via drill 0.55)
  Top 0.356: C5.+ 16.51,25.4 19.05,25.4 20.32,24.13 20.32,16.51 21.59,15.24 25.4,15.24 | 25.4,15.24 C11.1 | 25.4,15.24 25.4,24.13 27.94,26.67 C12.+ | 5.08,68.58 v3.81,67.31
  Top 0.406: C7.+ 5.08,68.58
  Bottom 0.305: 46.99,3.81 86.36,3.81 | 10.16,20.32 10.08,20.4 9.67,20.4 8.97,21.1 8.97,22.08 9.67,22.78 12.62,22.78 13.97,24.13 12.7,25.4 12.7,29.21
  Bottom 0.356: C11.1 26.67,12.7 27.94,11.43 D3.A 33.02,11.43 35.56,13.97 40.64,13.97 41.91,12.7 D1.A | 12.7,50.8 12.7,46.99 13.97,45.72 | v3.81,67.31 7.62,63.5
  Bottom 0.406: U2.16 11.43,6.35 12.7,7.62 12.7,19.05 11.43,20.32 10.16,20.32 9.85,20.32 | 7.62,63.5 7.62,54.61 8.89,53.34 | 8.89,53.34 11.43,53.34 12.7,52.07 12.7,50.8 11.43,49.53 U3.16 | 8.89,53.34 6.35,50.8 6.35,46.99 7.62,45.72 7.62,33.02 8.89,31.75 11.43,31.75 12.7,30.48 12.7,29.21 11.43,27.94 U1.16 | D1.A D2.C 45.72,5.08 46.99,3.81 | R7.2 91.44,33.02 | 91.44,33.02 93.98,30.48 EXT1-MOTOR.16 | 91.44,33.02 88.9,33.02 87.63,31.75 87.63,16.51 88.9,15.24 C6.+ 90.17,10.16 92.71,12.7 95.25,12.7 96.52,11.43 96.52,10.16 95.25,8.89 93.98,8.89 91.44,6.35 88.9,6.35 86.36,3.81
  Bottom 0.508: 13.97,45.72 C9.+ | C7.+ 12.7,68.58 11.43,69.85 11.43,74.93 12.7,76.2 C1.+ | 13.97,24.13 C5.+
  Bottom 0.61: 97.75,58.42 FAN.2 101.22,54.95 101.22,49.15 99.02,46.95 EXT1.2 | EXT1.2 96.56,46.95 | 12V-IN.2 21.59,82.51 21.59,78.74 C2.+ C1.+ 16.51,78.74 MOD_IN.1 | EXT1.2 96.48,46.95 95.25,45.72 95.25,44.45 93.98,43.18 R7.2
  Bottom 0.813: FAN.2 95.21,58.38 92.71,55.88 R3.2
AM-VIN
  Bottom 0.305: D1.C 67.31,8.89 68.58,10.16 ARD-MEGA.VIN.1
  Bottom 0.508: ARD-MEGA.VIN.2 ARD-MEGA.VIN.1
B-LED
  Top 0.406: R20.2 52.02,57.15 Q7.1
CH-PD
  Bottom 0.406: SERIAL_0_EXP.6 R16.1
CH_PD
  Bottom 0.305: 67.31,12.7 73.66,12.7
  Bottom 0.406: WIFI-SERIAL3.5 74.93,13.97
  Bottom 0.508: R15.1 66.04,11.43 67.31,12.7 | 73.66,12.7 74.93,13.97
D1
  Bottom 0.305: 63.5,31.75 66,29.25 66,25.44 66.04,25.4
  Bottom 0.406: SERIAL_0_EXP.2 55.88,33.02 57.15,31.75 63.5,31.75 | ARD-MEGA.RX 67.31,24.13 66.04,25.4
D2
  Bottom 0.406: SERIAL_0_EXP.1 58.42,34.29 59.69,33.02 63.5,33.02 66.6,29.92 66.6,26.11 67.31,25.4 69.85,25.4 ARD-MEGA.TX
D7
  Top 0.406: ARD-MEGA.D7 73.66,31.75 76.2,34.29 76.2,35.56 78.74,38.1 86.36,38.1 88.9,35.56 BL-TOUCH.1
D8
  Top 0.305: 71.12,43.18 71.03,43.09 70.63,43.09 69.76,42.22 69.76,41.42 68.98,40.64 68.84,40.64
  Top 0.356: R1.1 86.36,71.12 85.09,72.39 77.47,72.39 74.93,69.85 74.93,45.72 72.39,43.18 71.12,43.18 70.86,43.18 | ARD-MEGA.D8 67.31,34.29 66.04,35.56 66.04,39.37 67.31,40.64 68.84,40.64
  Bottom 0.508: R11.1 R1.1
D9
  Top 0.305: 71.12,40.64 70.72,40.64 69.76,39.68 69.76,38.88 68.9,38.01 68.09,38.01 67.4,37.32 67.4,36.92 67.31,36.83 67.4,36.74 67.4,36.34 68.09,35.65 68.49,35.65 68.58,35.56
  Top 0.356: ARD-MEGA.D9 69.85,35.56 68.58,35.56 68.32,35.56 | 71.12,40.64 72.39,40.64 76.2,44.45 76.2,60.96 77.47,62.23 90.17,62.23 R4.1
  Bottom 0.61: R4.1 R2.1
D10
  Top 0.305: 71.12,38.1 72.39,38.1 76.89,42.6 76.89,43.87
  Top 0.356: ARD-MEGA.D10 69.85,38.1 71.12,38.1 71.38,38.1 | R8.1 90.17,49.53 77.47,49.53 76.89,48.95 76.89,43.87
  Bottom 0.406: R5.1 R8.1
D16
  Top 0.305: ARD-MEGA.D16 67.31,44.45 66.04,45.72 EXP1.4
D17
  Bottom 0.305: 72.39,44.45 73.66,45.72 73.66,73.66 72.39,74.93 67.31,74.93 66.04,73.66 EXP1.3
  Bottom 0.508: ARD-MEGA.D17 72.39,44.45
D23
  Bottom 0.305: EXP1.5 64.77,71.12 69.85,71.12 72.39,68.58 72.39,53.34 ARD-MEGA.D23
D25
  Top 0.305: EXP1.6 64.77,71.12 69.85,71.12 71.12,69.85 71.12,66.04 69.85,64.77 68.58,64.77 67.31,63.5 67.31,57.15 67.31,56.92 | 68.35,55.88 68.58,55.88 69.85,55.88 ARD-MEGA.D25
  Top 0.356: 68.58,55.88 68.52,55.94 68.08,55.94 67.37,56.65 67.37,57.09 67.31,57.15
D27
  Top 0.305: 72.39,60.96 71.12,60.96 70.89,60.96 | 69.85,72.39 69.85,73.66 69.31,74.2 62.77,74.2 EXP1.7
  Top 0.356: ARD-MEGA.D27 69.85,58.42 69.85,60.13 70.62,60.9 71.06,60.9 71.12,60.96 | 72.39,60.96 73.09,61.66 73.09,69.15 69.85,72.39
D29  (via drill 0.55)
  Top 0.305: ARD-MEGA.D29 72.39,59.69 73.66,60.96 73.66,69.85 71.12,72.39 71.12,73.66 69.85,74.93 62.23,74.93 60.96,73.66 55.88,73.66
  Top 0.356: 55.88,73.66 v54.61,72.39
  Bottom 0.305: v54.61,72.39 54.61,71.12 57.15,68.58 59.69,68.58 EXP1.8
D31
  Bottom 0.356: 67.31,66.04 69.85,66.04 71.12,64.77 ARD-MEGA.D31
  Bottom 0.406: 67.31,66.04 53.34,66.04 50.8,68.58 50.8,71.12 EXP2.3
D33
  Bottom 0.305: 34.29,46.99 34.38,46.9 34.38,46.5 35.16,45.72 35.56,45.72
  Bottom 0.406: EXP2.5 45.72,71.12 45.72,68.58 41.91,64.77 35.56,64.77 34.29,63.5 34.29,46.99 34.29,46.69 | 35.56,45.72 36.83,45.72 ARD-MEGA.D33
D35  (via drill 0.55)
  Top 0.305: 45.72,55.88 45.72,57.15 55.88,67.31
  Top 0.356: 55.88,67.31 v60.96,67.31
  Top 0.406: ARD-MEGA.D35 39.37,48.26 44.45,48.26 45.72,49.53 45.72,55.88
  Bottom 0.356: v60.96,67.31 67.31,67.31 68.58,68.58 EXP1.2
D37
  Top 0.305: 44.45,55.88 44.45,56.92 46.03,58.51 46.21,58.51 55.88,68.18 55.88,69.85 57.15,71.12 63.91,71.12 64.85,72.06 64.85,72.88 65.55,73.58 67.23,73.58 67.31,73.66 EXP1.1
  Top 0.406: ARD-MEGA.D37 39.37,50.8 43.18,50.8 44.45,52.07 44.45,55.88
D41
  Top 0.305: 41.91,58.59 41.56,58.24 41.46,58.24 39.62,56.4 39.62,56.3
  Top 0.406: EXP2.8 44.45,68.58 41.91,66.04 41.91,58.59 | 39.62,56.3 39.62,56.13 ARD-MEGA.D41
D44
  Bottom 0.305: 38.1,60.96 38.19,60.87 38.59,60.87 39.37,60.09 39.37,59.69
  Bottom 0.406: R21.1 R18.1 40.64,53.34 40.64,55.88 39.37,57.15 39.37,59.69 | ARD-MEGA.D44 36.83,60.96 38.1,60.96 38.4,60.96
D45
  Bottom 0.305: 37.8,48.26 37.7,48.26 36.83,49.13 36.83,49.53
  Bottom 0.406: R22.1 R19.1 40.64,48.26 37.8,48.26 | 36.83,49.53 36.83,58.42 ARD-MEGA.D45
D46
  Top 0.305: 36.83,54.61 36.92,54.52 36.92,54.12 37.7,53.34 38.1,53.34
  Top 0.406: ARD-MEGA.D46 36.83,60.96 36.83,54.61 36.83,54.31 | 38.1,53.34 40.64,53.34 R23.1
  Bottom 0.406: R20.1 R23.1
D49
  Bottom 0.305: 47.3,73.66 47.4,73.66 48.26,72.8 48.26,72.7
  Bottom 0.406: EXP2.7 45.72,73.66 46.99,73.66 47.3,73.66 | 48.26,72.7 48.26,68.58 45.72,66.04 44.45,66.04 41.91,63.5 41.91,60.96 ARD-MEGA.D49
D50
  Top 0.406: ARD-MEGA.D50 43.18,66.04 45.72,68.58 45.72,69.85 45.72,70.16 45.72,73.66 46.99,74.93 50.8,74.93 52.07,73.66 EXP2.1
D51
  Top 0.406: ARD-MEGA.D51 44.45,60.96 44.45,66.04 46.99,68.58 EXP2.6
D52
  Top 0.356: 52.07,68.58 ARD-MEGA.D52
  Top 0.406: EXP2.2 52.07,68.58
D53
  Top 0.406: ARD-MEGA.D53 54.61,68.58 54.61,69.85 53.34,71.12 50.8,71.12 EXP2.4
E0-DIR  (via drill 0.55)
  Top 0.356: EXT1-MOTOR.8 80.01,11.43 78.74,12.7 v78.74,27.94
  Bottom 0.356: v78.74,27.94 73.66,33.02 67.31,33.02 64.77,35.56 64.77,58.42 66.04,59.69 ARD-MEGA.D28
E0-EN
  Bottom 0.356: EXT1-MOTOR.1 80.01,29.21 73.66,35.56 67.31,35.56 66.04,36.83 66.04,53.34 67.31,54.61 ARD-MEGA.D24
E0-STEP  (via drill 0.55)
  Top 0.305: 81.28,20.32 81.2,20.4 80.79,20.4 80.01,21.17 80.01,21.59
  Top 0.356: EXT1-MOTOR.7 82.55,13.97 83.82,15.24 83.82,19.05 82.55,20.32 81.28,20.32 81,20.32 | v80.01,31.75 80.01,21.59
  Bottom 0.305: 69.85,39.37 69.94,39.28 69.94,38.88 70.63,38.19 71.03,38.19 71.12,38.1
  Bottom 0.356: ARD-MEGA.D26 69.85,55.88 69.85,39.37 69.85,39.11 | 70.86,38.1 71.12,38.1 73.66,38.1 v80.01,31.75
E1-1A
  Top 0.61: EXT1-MOTOR.12 EXT1_MOTOR.2
E1-1B
  Top 0.61: EXT1-MOTOR.11 EXT1_MOTOR.1
E1-2A
  Top 0.61: EXT1-MOTOR.13 EXT1_MOTOR.3
E1-2B
  Top 0.61: EXT1-MOTOR.14 EXT1_MOTOR.4
FAN-CTRL
  Bottom 0.305: ARD-MEGA.D6 69.85,30.48 71.12,30.48 | 64.77,24.13 66.04,22.86 71.52,22.86 72.3,23.64 72.3,24.04 72.39,24.13 | 71.12,30.48 71.35,30.48 | 72.39,23.9 72.39,24.13 | 72.39,29.44 72.39,29.21 | 72.39,29.21 72.39,24.13 | 71.12,30.48 71.21,30.39 71.61,30.39 72.3,29.7 72.3,29.3 72.39,29.21 | 63.67,29.21 63.77,29.21 64.77,28.21 64.77,28.11
  Bottom 0.356: 54.61,29.21 53.34,27.94 53.34,21.59 52.07,20.32 43.18,20.32 41.91,19.05 R14.1
  Bottom 0.406: 64.77,28.11 64.77,24.13 | 54.61,29.21 63.67,29.21
FAN-V
  Top 0.356: C12.- 30.48,25.4 26.67,21.59 C11.2 | FAN1.1 31.75,8.89 33.02,10.16 33.02,16.51 31.75,17.78
  Top 0.406: C11.2 Q4.D 31.75,17.78
FILM-SENS
  Top 0.305: 69.85,21.59 69.94,21.68 69.94,22.08 70.81,22.95 71.61,22.95 72.39,23.73 72.39,23.83
  Top 0.406: ARD-MEGA.D5 72.39,27.94 72.39,23.83 | FIL-SENS.1 74.93,7.62 73.66,8.89 71.12,8.89 69.85,10.16 69.85,21.59 69.85,21.89
G-LED
  Top 0.406: R19.2 52.02,46.99 Q6.1
GND  (via drill 0.55)
  Top 0.305: U3.9 6.35,67.31 2.54,63.5 2.54,31.75 3.81,30.48
  Top 0.356: EXT1-MOTOR.9 91.44,13.97 91.44,24.13 EXT1-MOTOR.15 | 3.81,30.48 v5.08,30.48
  Top 0.406: U2.9 12.7,24.13 13.97,22.86 16.51,22.86 C5.- | U1.9 11.43,45.72 12.7,44.45 16.51,44.45 C9.- | C16.2 58.42,46.99 55.88,44.45 52.07,44.45 | 52.07,44.45 52.04,44.47 | C17.2 58.42,57.15 56.2,54.93 Q7.2 53.34,53.93 53.34,50.8 52.34,49.8 | R22.2 52.07,44.45 | R23.2 49.55,54.63 52.04,54.63 52.07,54.61 | Q6.2 52.34,44.72 52.07,44.45 | 52.34,49.8 Q5.2 | R21.2 52.07,49.53 52.34,49.8
  Top 0.508: C14.- 6.35,77.47 10.16,73.66 C1.-
  Bottom 0.305: MOD_IN.2 17.78,85.09 25.4,85.09 26.67,83.82 26.67,82.55 26.67,82.51 | 47.52,36.09 46.99,35.56 44.45,35.56 41.91,38.1 30.48,38.1
  Bottom 0.356: 77.47,16.51 78.74,15.24 78.74,11.43 80.01,10.16 | 35.56,16.51 R17.2 39.37,16.51 41.91,13.97 49.53,13.97 | 21.59,20.32 26.67,20.32 27.3,19.68 27.94,19.05 33.02,19.05 35.56,16.51 | Q4.S 34.29,15.24 35.56,16.51 | MOD_OUT.2 MOD_IN.2 | C8.- 27.94,40.64 30.48,38.1 | v5.08,30.48 8.89,30.48
  Bottom 0.406: C10.- C4.- | C9.- 20.32,45.72 21.59,46.99 26.67,46.99 27.94,45.72 C8.- THERM0.1 C3.- THERM1.1 | Y-STOP.2 Z-STOP.2 D2.A 48.26,5.08 46.99,6.35 46.99,11.43 | 80.01,10.16 C6.- | EXT1-MOTOR.9 90.17,7.62 86.36,7.62 | C5.- 21.59,20.32 | 47.52,36.09 48.26,36.83 SERIAL_0_EXP.5 48.26,41.91 49.53,43.18 R22.2 | R22.2 48.26,45.72 48.26,48.26 R21.2 48.26,50.8 48.26,53.34 R23.2 | C15.2 C17.2 58.42,63.5 C21.- 60.96,64.77 63.5,62.23 C20.- 63.5,44.45 C19.- 60.96,43.18 58.42,45.72 58.42,46.99 | C16.2 58.42,46.99 | R22.2 55.88,44.45 58.42,46.99 | 27.3,19.68 27.3,20.96 27.94,21.59 40.64,21.59 RGB-B-G-R.4 | 86.36,7.62 83.82,5.08 C18.2 FIL-SENS.2 | 86.36,8.89 86.36,7.62 | 74.93,16.51 WIFI-SERIAL3.4 77.47,16.51
  Bottom 0.508: ARD-MEGA.GND.1 ARD-MEGA.GND.2 72.39,13.97 74.93,16.51 | U3.15 8.89,52.07 7.62,50.8 7.62,46.99 8.89,45.72 U1.9 | U1.15 8.89,30.48 7.62,29.21 7.62,25.4 8.89,24.13 U2.9 | C4.- 57.15,21.59 54.61,24.13 54.61,26.67 R10.1 | C10.- 57.15,13.97 49.53,13.97 48.26,13.97 46.99,12.7 46.99,11.43 | Y-STOP.2 X-STOP.2 FIL-SENS.2 | C1.- 13.97,72.39 15.24,71.12 16.51,71.12 17.78,69.85 C7.- | 25.4,79.97 25.4,80.01 26.67,81.28 26.67,82.51 12V-IN.1 | MOD_OUT.2 11.43,83.82 C13.2 C14.- | C6.- 86.36,8.89 | EXP1.9 58.42,74.93 | 76.2,73.66 77.47,72.39 77.47,68.58 | 77.47,68.58 77.47,57.15 | 77.47,57.15 77.47,48.26 78.74,46.99 Q3.S | 77.47,57.15 78.74,58.42 Q2.S | 77.47,68.58 78.74,69.85 Q1.S | EXT1-MOTOR.15 97.79,26.67 99.06,27.94 BL-TOUCH.2
  Bottom 0.61: Q3.S 81.28,46.99 82.55,48.26 R8.2 | Q2.S 82.55,60.96 R4.2 | Q1.S 81.28,71.12 81.28,72.39 82.55,73.66 R11.2 | U3.9 13.97,67.31 15.24,66.04 16.51,66.04 17.78,67.31 C7.- 19.05,69.85 26.67,69.85 27.94,68.58 THERM1.1 | C1.- C2.- 22.86,73.66 25.4,76.2 25.4,79.97 | 7.62,25.4 7.62,10.16 8.89,8.89 U2.15 | 58.42,74.93 57.15,76.2 | 57.15,76.2 43.18,76.2 41.91,74.93 | 57.15,76.2 73.66,76.2 76.2,73.66
  Bottom 1.27: 41.91,74.93 EXP2.9 39.37,72.39
  Bottom 2.54: 26.67,82.55 27.94,81.28 U$1.- 35.56,79.94 35.56,76.2 39.37,72.39
L-B  (via drill 0.55)
  Top 0.305: RGB-B-G-R.3 45.72,34.29 46.99,35.56
  Top 0.356: 46.99,35.56 v46.99,54.61
  Top 0.406: Q7.3 54.44,56.98 C17.1 57.15,59.69 C21.+
  Bottom 0.305: C21.+ 52.07,62.23 46.99,57.15
  Bottom 0.356: 46.99,57.15 v46.99,54.61
L-G
  Top 0.305: RGB-B-G-R.2 48.26,33.02 49.53,34.29 49.53,41.91 48.26,43.18 48.26,47.26 49.26,48.26 C16.1
  Top 0.406: Q6.3 54.44,46.82 C16.1 57.15,49.53 59.69,49.53 62.23,46.99 C19.+
L-R
  Top 0.305: RGB-B-G-R.1 50.8,33.02 52.07,34.29 52.07,42.18 53.07,43.18 53.24,43.18 53.34,43.18 59.69,43.18 60.96,44.45 62.61,44.45 63.4,45.23 63.4,45.62 63.5,45.72 | C20.+ 63.5,48.26 63.5,45.72 | 63.5,45.72 63.5,45.45
  Top 0.406: C15.1 54.44,51.9 Q5.3 C20.+
N$1
  Bottom 0.356: Q2.G 81.28,53.34 82.55,54.61 82.55,57.15 R2.2
N$2
  Top 0.356: Q2.D 81.28,55.88 83.82,53.34 87.63,53.34 LED3.K
  Bottom 0.61: LED3.K 90.21,53.38 FAN.1
N$3
  Bottom 0.356: R3.1 85.09,55.88 86.36,54.61 LED3.A
N$4
  Bottom 0.508: Q3.G 81.28,41.91 82.55,43.18 82.55,44.45 R5.2
N$5
  Top 0.356: Q3.D 86.36,44.45 88.9,41.91 LED4.K
  Top 0.61: EXT1.1 95.21,39.37 LED4.K
N$6
  Bottom 0.356: R7.1 85.09,43.18 86.36,41.91 LED4.A
N$7
  Top 0.305: Q1.D 81.28,67.31 85.09,63.5 87.63,63.5 LED2.K
  Bottom 1.27: U$2.- 96.59,64.77 LED2.K
N$8
  Bottom 0.508: R6.1 85.09,68.58 86.36,67.31 LED2.A
N$9
  Top 0.508: SV1.5 19.05,33.02 21.59,35.56 U1.4
N$10
  Top 0.61: SV1.3 19.05,30.48 21.59,33.02 U1.3
N$11
  Top 0.508: SV1.1 19.05,27.94 21.59,30.48 U1.2
N$12
  Bottom 0.508: U2.6 U2.5
N$13
  Bottom 0.508: U1.5 U1.6
N$14
  Top 0.61: SV2.1 19.05,6.35 21.59,8.89 U2.2
N$15
  Top 0.61: SV2.3 19.05,8.89 21.59,11.43 U2.3
N$16
  Top 0.61: SV2.5 19.05,11.43 21.59,13.97 U2.4
N$17
  Bottom 0.508: U3.5 U3.6
N$18
  Bottom 0.305: R13.2 58.42,22.86 64.77,22.86 67.31,20.32 72.39,20.32 73.66,21.59 73.66,22.86 74.93,24.13 WIFI-SERIAL3.1
  Bottom 0.508: R13.2 58.42,27.94 R10.2
N$19
  Top 0.406: SV3.3 19.05,52.07 21.59,54.61 U3.3
N$20
  Top 0.305: Q1.G 77.47,64.77 76.2,66.04 76.2,67.31 77.47,68.58 81.28,68.58 R1.2
N$21
  Top 0.406: SV3.1 19.05,49.53 21.59,52.07 U3.2
N$22
  Top 0.406: SV3.5 19.05,54.61 21.59,57.15 U3.4
N$23
  Bottom 0.508: EXT1-MOTOR.5 EXT1-MOTOR.6
N$24
  Top 0.61: SV4.3 83.82,26.67 EXT1-MOTOR.3
N$25
  Top 0.61: SV4.5 83.82,24.13 EXT1-MOTOR.4
N$26
  Top 0.61: EXT1-MOTOR.2 83.82,29.21 SV4.1
N$27
  Bottom 0.356: R14.2 R17.1 43.18,17.78 35.56,17.78 33.02,20.32 Q4.G
N$28
  Bottom 0.356: FAN1.2 26.67,7.62 27.94,6.35 36.83,6.35 38.1,7.62 38.1,10.16 39.37,11.43 D3.C
N$29
  Bottom 2.54: U$1.+ F20A.1A
N$30
  Bottom 0.508: MOD_OUT.1 12.7,80.01 11.43,78.74 C13.1 C14.+ 7.62,72.39 5V_SOURCE.3
N$32
  Bottom 0.305: PWR-SEL.2 82.55,34.29 85.09,31.75 85.09,21.59 83.82,20.32 78.74,20.32 77.47,19.05 WIFI-SERIAL3.3
N$33
  Top 0.406: C18.1 86.36,7.62 88.9,5.08 JP1.2
R-LED
  Top 0.406: Q5.1 52.02,52.07 R18.2
RESET
  Top 0.406: ARD-MEGA.RST 72.39,21.59 73.66,20.32 73.66,11.43 74.93,10.16 78.74,10.16 80.01,8.89 80.01,5.08 81.28,3.81 87.63,3.81 R24.1
  Bottom 0.406: JP1.1 R24.1
RX3
  Bottom 0.305: WIFI-SERIAL3.2 77.47,21.59 78.74,22.86 82.55,22.86 83.82,24.13 83.82,30.48 81.28,33.02 81.28,36.83 80.01,38.1 76.2,38.1
  Bottom 0.406: ARD-MEGA.D15 72.39,41.91 76.2,38.1
THERM0
  Top 0.356: C8.+ 30.48,41.91 34.29,38.1 36.83,38.1 ARD-MEGA.A13
  Bottom 0.406: R12.1 33.02,53.34 THERM0.2 C8.+
THERM1
  Top 0.305: 35.86,53.34 35.96,53.34 36.83,52.47 36.83,52.37
  Top 0.356: ARD-MEGA.A14 36.83,43.18
  Top 0.406: 35.86,53.34 35.56,53.34 31.75,53.34 30.48,54.61 C3.+ | 36.83,52.37 36.83,43.18
  Bottom 0.305: C3.+ 33.02,62.23 R9.1
  Bottom 0.406: THERM1.2 30.48,66.04 31.75,64.77 R9.1
TX3
  Top 0.406: ARD-MEGA.D14 67.31,41.91 60.96,35.56 60.96,26.67 62.23,25.4 R13.1
X-1A
  Top 0.508: MOTOR_X.2 U1.12
X-1B
  Top 0.508: MOTOR_X.1 U1.11
X-2A
  Top 0.508: MOTOR_X.3 U1.13
X-2B
  Top 0.508: MOTOR_X.4 U1.14
X-DIR
  Top 0.356: U1.8 24.13,45.72 27.94,41.91 27.94,38.1 33.02,33.02 39.37,33.02 40.64,31.75 40.64,25.4 39.37,24.13 ARD-MEGA.A1
X-EN
  Top 0.356: U1.1 25.4,30.48 25.4,40.64 24.13,41.91 21.59,41.91 20.32,43.18 20.32,49.53 21.59,50.8
  Top 0.406: 21.59,50.8 24.13,50.8 26.67,48.26 31.75,48.26 33.02,49.53 33.02,50.8 34.29,52.07 ARD-MEGA.D38
X-MIN
  Top 0.305: 67.31,24.13 67.31,24.53 68.18,25.4 69.85,25.4
  Top 0.356: 69.85,25.4 ARD-MEGA.D3 | 67.31,24.13 67.31,20.32 66.04,19.05 66.04,11.43 69.85,7.62 X-STOP.1
X-STEP
  Top 0.305: ARD-MEGA.A0 34.29,24.13 33.02,25.4 33.02,30.48 26.67,36.83
  Top 0.356: U1.7 24.13,43.18 26.67,40.64 26.67,36.83
Y-1A
  Top 0.508: MOTOR_Y.2 U2.12
Y-1B
  Top 0.508: MOTOR_Y.1 U2.11
Y-2A
  Top 0.508: MOTOR_Y.3 U2.13
Y-2B
  Top 0.508: MOTOR_Y.4 U2.14
Y-DIR
  Bottom 0.305: 34.29,30.48 36.83,30.48
  Bottom 0.406: U2.8 31.75,24.13 33.02,25.4 33.02,29.21 34.29,30.48 | 36.83,30.48 ARD-MEGA.A7
Y-EN
  Top 0.305: ARD-MEGA.A2 36.83,25.4 36.83,21.59 35.56,20.32 35.56,10.16 31.75,6.35
  Top 0.356: U2.1 31.75,6.35
Y-MIN
  Top 0.356: Y-STOP.1 64.77,20.32 66.04,21.59 66.04,27.94 67.31,29.21 ARD-MEGA.D4
Y-STEP
  Bottom 0.406: ARD-MEGA.A6 36.83,33.02 39.37,33.02 40.64,31.75 40.64,24.13 39.37,22.86 24.13,22.86 U2.7
Z-1A
  Top 0.508: MOTOR_Z.2 U3.12
Z-1B
  Top 0.508: MOTOR_Z.1 U3.11
Z-2A
  Top 0.508: MOTOR_Z.3 U3.13
Z-2B
  Top 0.508: MOTOR_Z.4 U3.14
Z-DIR
  Top 0.406: U3.8 22.86,71.12 24.13,72.39 29.21,72.39 33.02,68.58 33.02,67.31 35.56,64.77 39.37,64.77 40.64,63.5 ARD-MEGA.D48
Z-EN
  Top 0.356: U3.1 25.4,46.99 30.48,46.99 31.75,45.72 31.75,43.18 34.29,40.64 39.37,40.64 40.64,39.37 40.64,36.83 39.37,35.56 36.83,35.56 ARD-MEGA.A8
Z-MIN
  Top 0.305: 68.58,43.18 68.98,43.18 69.85,44.05 69.85,45.72
  Top 0.356: ARD-MEGA.D18 69.85,45.72 69.85,44.19 | 68.58,43.18 67.31,43.18 59.69,35.56 59.69,8.89 Z-STOP.1
Z-STEP
  Top 0.356: U3.7 25.4,62.23
  Top 0.406: 25.4,62.23 31.75,62.23 33.02,60.96 33.02,58.42 34.29,57.15 ARD-MEGA.D42